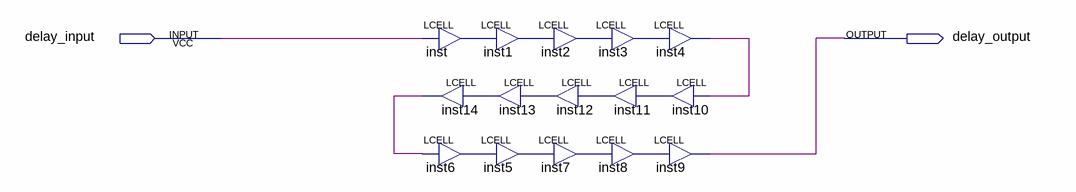
[diagram p0: schematic sheet]
// Quartus schematic uncertain_delay.bdf as structural Verilog: 15 symbols, 2 pins
module uncertain_delay (
  input  delay_input,
  output delay_output
);

  wire inst1_out, inst2_out, inst3_out, inst4_out, inst5_out, inst6_out, inst7_out, inst8_out, inst10_out,
       inst11_out, inst12_out, inst13_out, inst14_out, inst_out;

  LCELL inst (.IN(delay_input), .OUT(inst_out));
  LCELL inst14 (.IN(inst13_out), .OUT(inst14_out));
  LCELL inst6 (.IN(inst14_out), .OUT(inst6_out));
  LCELL inst1 (.IN(inst_out), .OUT(inst1_out));
  LCELL inst13 (.IN(inst12_out), .OUT(inst13_out));
  LCELL inst5 (.IN(inst6_out), .OUT(inst5_out));
  LCELL inst2 (.IN(inst1_out), .OUT(inst2_out));
  LCELL inst3 (.IN(inst2_out), .OUT(inst3_out));
  LCELL inst11 (.IN(inst10_out), .OUT(inst11_out));
  LCELL inst12 (.IN(inst11_out), .OUT(inst12_out));
  LCELL inst7 (.IN(inst5_out), .OUT(inst7_out));
  LCELL inst8 (.IN(inst7_out), .OUT(inst8_out));
  LCELL inst4 (.IN(inst3_out), .OUT(inst4_out));
  LCELL inst10 (.IN(inst4_out), .OUT(inst10_out));
  LCELL inst9 (.IN(inst8_out), .OUT(delay_output));
endmodule
